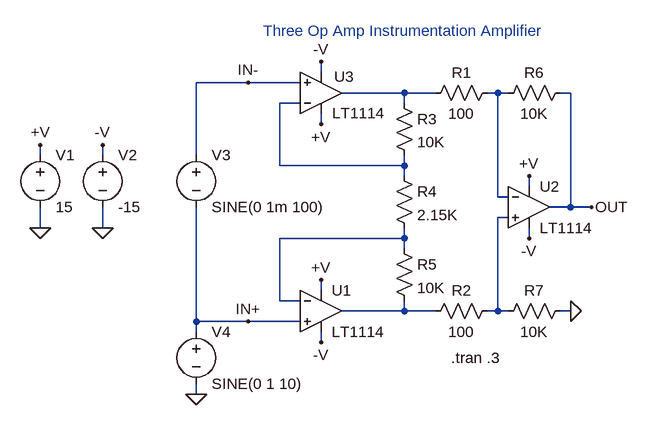
[diagram p0: schematic 1114.asc]
1114.asc, the LTspice schematic file:
Version 4
SHEET 1 896 680
WIRE 208 80 208 64
WIRE 96 96 16 96
WIRE 176 96 96 96
WIRE 336 112 240 112
WIRE 384 112 336 112
WIRE 480 112 464 112
WIRE 496 112 480 112
WIRE 592 112 576 112
WIRE 176 128 144 128
WIRE 336 128 336 112
WIRE 208 160 208 144
WIRE -224 208 -224 192
WIRE -128 208 -128 192
WIRE 16 208 16 96
WIRE 144 224 144 128
WIRE 336 224 336 208
WIRE 336 224 144 224
WIRE 336 240 336 224
WIRE 528 256 528 240
WIRE 480 272 480 112
WIRE 496 272 480 272
WIRE 592 288 592 112
WIRE 592 288 560 288
WIRE 624 288 592 288
WIRE 496 304 480 304
WIRE -224 320 -224 288
WIRE -128 320 -128 288
WIRE 336 336 336 320
WIRE 336 336 144 336
WIRE 528 336 528 320
WIRE 336 352 336 336
WIRE 208 416 208 400
WIRE 144 432 144 336
WIRE 176 432 144 432
WIRE 336 448 336 432
WIRE 336 448 240 448
WIRE 384 448 336 448
WIRE 480 448 480 304
WIRE 480 448 464 448
WIRE 496 448 480 448
WIRE 592 448 576 448
WIRE 16 464 16 288
WIRE 96 464 16 464
WIRE 176 464 96 464
WIRE 16 480 16 464
WIRE 208 496 208 480
WIRE 16 576 16 560
FLAG -224 320 0
FLAG 208 160 +V
FLAG -224 192 +V
FLAG 208 400 +V
FLAG 16 576 0
FLAG -128 320 0
FLAG -128 192 -V
FLAG 208 64 -V
FLAG 208 496 -V
FLAG 528 240 +V
FLAG 528 336 -V
FLAG 592 448 0
FLAG 624 288 OUT
FLAG 96 464 IN+
FLAG 96 96 IN-
SYMBOL voltage -224 192 R0
SYMATTR InstName V1
SYMATTR Value 15
SYMBOL voltage -128 192 R0
SYMATTR InstName V2
SYMATTR Value -15
SYMBOL res 320 112 R0
SYMATTR InstName R3
SYMATTR Value 10K
SYMBOL res 320 224 R0
SYMATTR InstName R4
SYMATTR Value 2.15K
SYMBOL res 320 336 R0
SYMATTR InstName R5
SYMATTR Value 10K
SYMBOL voltage 16 192 R0
WINDOW 123 0 0 Left 0
WINDOW 39 0 0 Left 0
SYMATTR InstName V3
SYMATTR Value SINE(0 1m 100)
SYMBOL voltage 16 464 R0
WINDOW 123 0 0 Left 0
WINDOW 39 0 0 Left 0
SYMATTR InstName V4
SYMATTR Value SINE(0 1 10)
SYMBOL res 480 96 R90
WINDOW 0 0 56 VBottom 0
WINDOW 3 32 56 VTop 0
SYMATTR InstName R1
SYMATTR Value 100
SYMBOL res 480 432 R90
WINDOW 0 0 56 VBottom 0
WINDOW 3 32 56 VTop 0
SYMATTR InstName R2
SYMATTR Value 100
SYMBOL res 592 96 R90
WINDOW 0 0 56 VBottom 0
WINDOW 3 32 56 VTop 0
SYMATTR InstName R6
SYMATTR Value 10K
SYMBOL res 592 432 R90
WINDOW 0 0 56 VBottom 0
WINDOW 3 32 56 VTop 0
SYMATTR InstName R7
SYMATTR Value 10K
SYMBOL opamps\\LT1114 208 384 R0
SYMATTR InstName U1
SYMBOL opamps\\LT1114 528 224 R0
SYMATTR InstName U2
SYMBOL opamps\\LT1114 208 176 M180
WINDOW 0 20 89 Left 0
WINDOW 3 17 33 Left 0
SYMATTR InstName U3
TEXT 408 520 Left 0 !.tran .3
TEXT 336 32 Bottom 0 ;Three Op Amp Instrumentation Amplifier

The netlist it stands for:
* 1114.asc
V1 +V 0 15
V2 -V 0 -15
R3 N001 N003 10K
R4 N003 N005 2.15K
R5 N005 N006 10K
V3 IN- IN+ SINE(0 1m 100)
V4 IN+ 0 SINE(0 1 10)
R1 N002 N001 100
R2 N004 N006 100
R6 OUT N002 10K
R7 0 N004 10K
XU1 IN+ N005 +V -V N006 LT1114  ; pins In+ In- V+ V- OUT
XU2 N004 N002 +V -V OUT LT1114  ; pins In+ In- V+ V- OUT
XU3 IN- N003 +V -V N001 LT1114  ; pins In+ In- V+ V- OUT
.tran .3
* Three Op Amp Instrumentation Amplifier
.backanno
.end